# EAGLE design EBN_SBAT_V03A (EAGLE 7.3.0)
CNAME: EasyBoard Nano; CREVISION: 2.0; DESIGNER: Martin Olejar
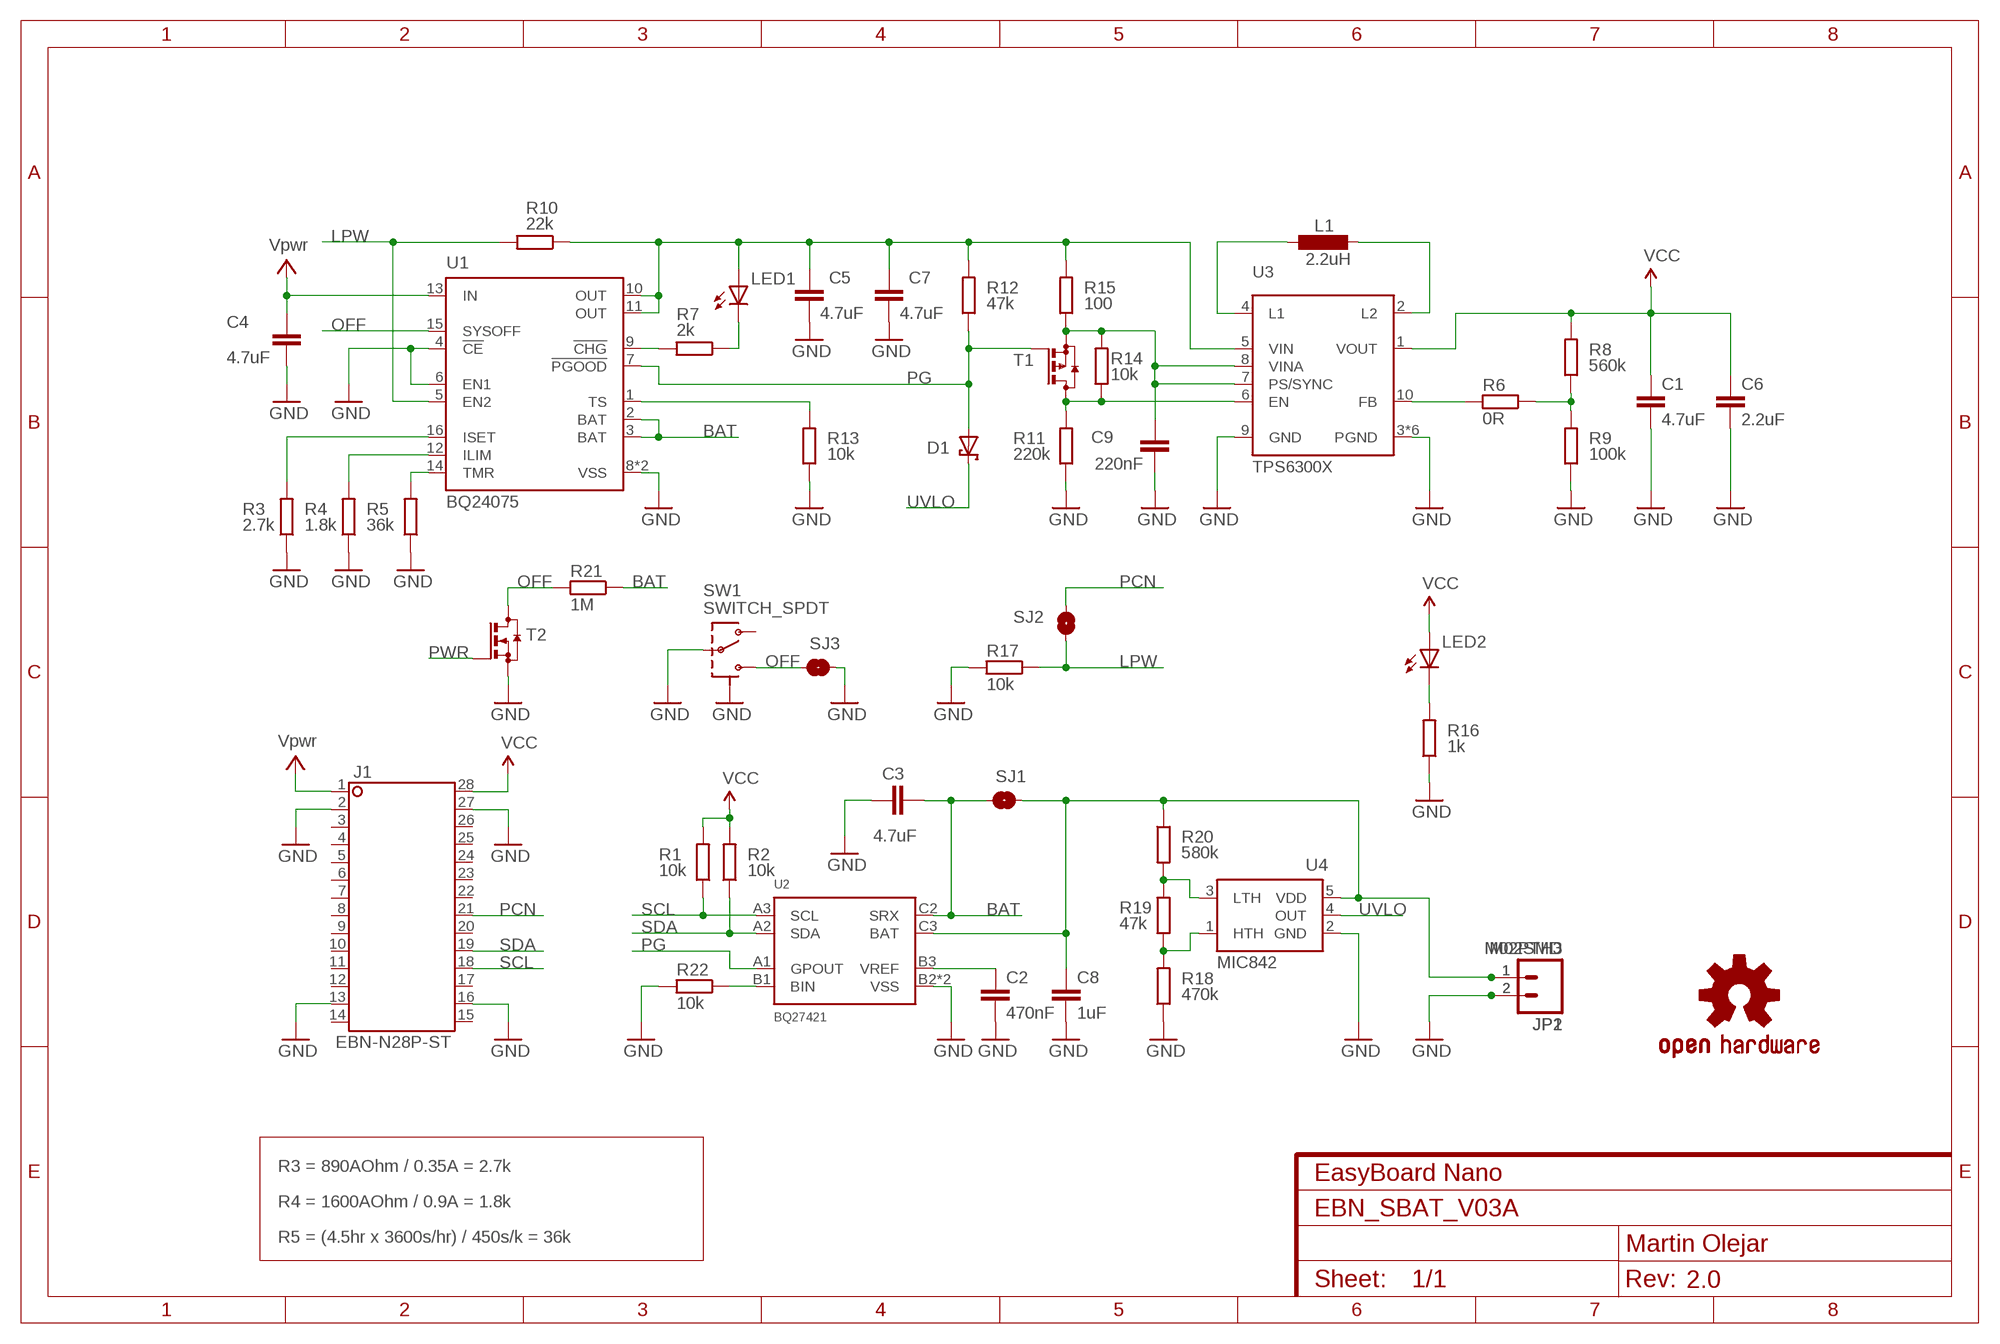
[diagram p0: schematic, sheet 1]

## Parts
C1  4.7uF  C-EUC0603  [C0603]
C2  470nF  C-EUC0402  [C0402]
C3  4.7uF  C-EUC0805  [C0805]
C4  4.7uF  C-EUC0603  [C0603]
C5  4.7uF  C-EUC0603  [C0603]
C6  2.2uF  C-EUC0603  [C0603]
C7  4.7uF  C-EUC0603  [C0603]
C8  1uF  C-EUC0402  [C0402]
C9  220nF  C-EUC0402  [C0402]
D1  -SHOTTKY-SOD323_ST  [SOD323_ST]
J1  EBN-N28P-ST  [EBN-N28P-SHIELD]
JP1  M02SMD  [1X02-1.25MM_SMD]
JP2  M02PTH3  [1X02_LONGPADS]
L1  2.2uH  L-EULPS3015  [LPS3015]
LED1  LEDCHIPLED_0603  [CHIPLED_0603]
LED2  LEDCHIPLED_0603  [CHIPLED_0603]
LOGO1  OSHW-LOGOS  [OSHW-LOGO-S]
R1  10k  R-EUR0402  [R0402]
R2  10k  R-EUR0402  [R0402]
R3  2.7k  R-EUR0402  [R0402]
R4  1.8k  R-EUR0402  [R0402]
R5  36k  R-EUR0402  [R0402]
R6  0R  R-EUR0402  [R0402]
R7  2k  R-EUR0402  [R0402]
R8  560k  R-EUR0402  [R0402]
R9  100k  R-EUR0402  [R0402]
R10  22k  R-EUR0402  [R0402]
R11  220k  R-EUR0402  [R0402]
R12  47k  R-EUR0402  [R0402]
R13  10k  R-EUR0402  [R0402]
R14  10k  R-EUR0402  [R0402]
R15  100  R-EUR0402  [R0402]
R16  1k  R-EUR0402  [R0402]
R17  10k  R-EUR0402  [R0402]
R18  470k  R-EUR0402  [R0402]
R19  47k  R-EUR0402  [R0402]
R20  580k  R-EUR0402  [R0402]
R21  1M  R-EUR0402  [R0402]
R22  10k  R-EUR0402  [R0402]
SJ1  SJ-S  [JUMPER-SMD-S1X]
SJ2  SJ-S  [JUMPER-SMD-S1X]
SJ3  SJ-S  [JUMPER-SMD-S1X]
SW1  SWITCH_SPDT  [SWITCH-SPST-SMD-A]
T1  -PMOS-SOT323  [SOT323]
T2  -NMOS-SOT323  [SOT323]
U1  BQ24075  [QFN16-3X3MM]
U2  BQ27421  [XBGA9]
U3  TPS6300X  [QFN-10_PAD]
U4  MIC842  [SC70]

## Nets
BAT: C3.1 R21.1 SJ1.2 U1.2(BAT) U1.3(BAT) U2.C2(SRX)
BATX: C8.2 JP1.1 JP2.1 R20.1 SJ1.1 U2.C3(BAT) U4.5(VDD)
GND: C1.2 C2.1 C3.2 C4.2 C5.2 C6.2 C7.2 C8.1 C9.2 J1.2 J1.13 J1.16 J1.27 JP1.2 JP2.2 R3.1 R4.1 R5.1 R9.1 R11.1 R13.1 R16.1 R17.2 R18.1 R22.2 SJ3.2 SW1.2(P) SW1.GND1(SH) SW1.GND2(SH) SW1.GND3(SH) SW1.GND4(SH) T2.2(S) U1.4(!CE) U1.6(EN1) U1.8(VSS) U1.EXT(VSS) U2.B2(VSS) U2.C1(VSS) U3.3(PGND) U3.9(GND) U3.11(PGND) U3.12(PGND) U3.13(PGND) U3.14(PGND) U3.15(PGND) U4.2(GND)
LPW: R10.2 R17.1 SJ2.1 U1.5(EN2)
N$1: L1.P$1 U3.4(L1)
N$2: L1.P$2 U3.2(L2)
N$3: LED2.C R16.2
N$4: C2.2 U2.B3(VREF)
N$5: R5.2 U1.14(TMR)
N$6: R4.2 U1.12(ILIM)
N$7: R18.2 R19.1 U4.1(HTH)
N$8: R19.2 R20.2 U4.3(LTH)
N$9: C9.1 R14.2 R15.1 T1.2(S) U3.7(PS/SYNC) U3.8(VINA)
N$10: R22.1 U2.B1(BIN)
N$11: R3.2 U1.16(ISET)
N$12: C5.1 C7.1 LED1.A R10.1 R12.2 R15.2 U1.10(OUT) U1.11(OUT) U3.5(VIN)
N$14: LED1.C R7.1
N$15: R7.2 U1.9(!CHG)
N$16: R11.2 R14.1 T1.3(D) U3.6(EN)
N$21: R6.1 R8.1 R9.2
N$24: R6.2 U3.10(FB)
OFF: R21.2 SJ3.1 SW1.3(S) T2.3(D) U1.15(SYSOFF)
PCN: J1.21 SJ2.2
PG: D1.A R12.1 T1.1(G) U1.7(!PGOOD) U2.A1(GPOUT)
PWR: C4.1 J1.1 T2.1(G) U1.13(IN) ; supply symbol labelled Vpwr
SCL: J1.18 R1.1 U2.A3(SCL)
SDA: J1.19 R2.1 U2.A2(SDA)
TS: R13.2 U1.1(TS)
UVLO: D1.C U4.4(OUT)
VCC: C1.1 C6.1 J1.28 LED2.A R1.2 R2.2 R8.2 U3.1(VOUT)
Unconnected: J1.3 J1.4 J1.5 J1.6 J1.7 J1.8 J1.9 J1.10 J1.11 J1.12 J1.14 J1.15 J1.17 J1.20 J1.22 J1.23 J1.24 J1.25 J1.26 SW1.1(O)

## Notes on the sheet
- R3 = 890AOhm / 0.35A = 2.7k
- R4 = 1600AOhm / 0.9A = 1.8k
- R5 = (4.5hr x 3600s/hr) / 450s/k = 36k

## Library data of the parts
C1-C9 = atomx_RLC:C-EU: CAPACITOR, European symbol
D1 = atomx_DiscreteSemi:*-SHOTTKY-
J1 = atomx_Boards:EBN-N28P: Dual In Line
JP1 JP2 = atomx_Connectors:M02: Standard 2-pin 0.1" header. Use with - straight break away headers ( PRT-00116) - right angle break away headers (PRT-00553) - swiss pins (PRT-00743) - machine pins (PRT-00117) - female headers (PRT-00115) Molex polarized connector foot print use with: PRT-08233 with associated crimp pins and housings. 2.54_SCREWTERM for use with PRT-10571. 3.5mm Screw Terminal footprints for PRT-08084 5mm Screw Terminal footprints for use with PRT-08432
L1 = atomx_RLC:L-EU: INDUCTOR, European symbol
LED1 LED2 = atomx_Optic:LED: LED OSRAM: - CHIPLED LG R971, LG N971, LY N971, LG Q971, LY Q971, LO R971, LY R971 LH N974, LH R974 LS Q976, LO Q976, LY Q976 LO Q996 - Hyper CHIPLED LW Q18S LB Q993, LB Q99A, LB R99A - SideLED LS A670, LO A670, LY A670, LG A670, LP A670 LB A673, LV A673, LT A673, LW A673 LH A674 LY A675 LS A676, LA A676, LO A676, LY A676, LW A676 LS A679, LY A679, LG A679 - Hyper Micro SIDELED® LS Y876, LA Y876, LO Y876, LY Y876 LT Y87S - SmartLED LW L88C, LW L88S LB L89C, LB L89S, LG L890 LS L89K, LO L89K, LY L89K LS L896, LA L896, LO L896, LY L896 - TOPLED LS T670, LO T670, LY T670, LG T670, LP T670 LSG T670, LSP T670, LSY T670, LOP T670, LYG T670 LG T671, LOG T671, LSG T671 LB T673, LV T673, LT T673, LW T673 LH T674 LS T676, LA T676, LO T676, LY T676, LB T676, LH T676, LSB T676, LW T676 LB T67C, LV T67C, LT T67C, LS T67K, LO T67K, LY T67K, LW E67C LS E67B, LA E67B, LO E67B, LY E67B, LB E67C, LV E67C, LT E67C LW T67C LS T679, LY T679, LG T679 LS T770, LO T770, LY T770, LG T770, LP T770 LB T773, LV T773, LT T773, LW T773 LH T774 LS E675, LA E675, LY E675, LS T675 LS T776, LA T776, LO T776, LY T776, LB T776 LHGB T686 LT T68C, LB T68C - Hyper Mini TOPLED® LB M676 - Mini TOPLED Santana® LG M470 LS M47K, LO M47K, LY M47K Source: http://www.osram.convergy.de LUXEON: - LUMILED® LXK2-PW12-R00, LXK2-PW12-S00, LXK2-PW14-U00, LXK2-PW14-V00 LXK2-PM12-R00, LXK2-PM12-S00, LXK2-PM14-U00 LXK2-PE12-Q00, LXK2-PE12-R00, LXK2-PE12-S00, LXK2-PE14-T00, LXK2-PE14-U00 LXK2-PB12-K00, LXK2-PB12-L00, LXK2-PB12-M00, LXK2-PB14-N00, LXK2-PB14-P00, LXK2-PB14-Q00 LXK2-PR12-L00, LXK2-PR12-M00, LXK2-PR14-Q00, LXK2-PR14-R00 LXK2-PD12-Q00, LXK2-PD12-R00, LXK2-PD12-S00 LXK2-PH12-R00, LXK2-PH12-S00 LXK2-PL12-P00, LXK2-PL12-Q00, LXK2-PL12-R00 Source: www.luxeon.com KINGBRIGHT: KA-3528ASYC Source: www.kingbright.com
LOGO1 = atomx_Common:OSHW-LOGO: Open Source Hardware Logo This logo indicates the piece of hardware it is found on incorporates a OSHW license and/or adheres to the definition of open source hardware found here: http://freedomdefined.org/OSHW
R1-R22 = atomx_RLC:R-EU: RESISTOR, European symbol
SJ1-SJ3 = atomx_Connectors:SJ: SMD solder JUMPER
SW1 = atomx_ElecMech:SWITCH_SPDT: SWCH-10651 Side-actuated SPDT slide switch, as used on the Arduino Pro
T1 = atomx_DiscreteSemi:*-PMOS-
T2 = atomx_DiscreteSemi:*-NMOS-
U1 = atomx_Power:BQ24075
U2 = atomx_Power:BQ27421
U3 = atomx_Power:TPS6300X
U4 = atomx_Power:MIC842

## Board
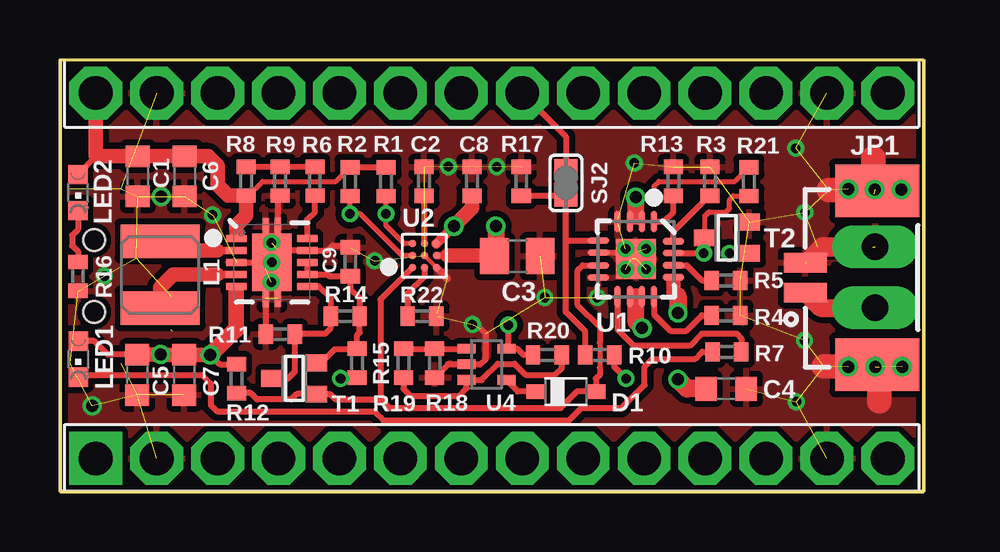
[diagram p1: board, top side]
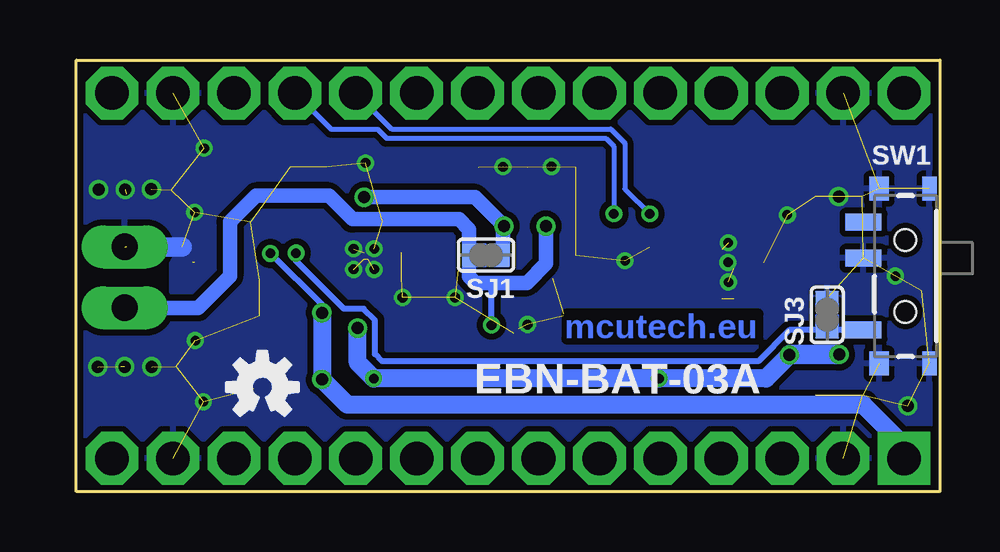
[diagram p2: board, bottom side, seen from below]

Size 36 x 18 mm. Coordinates in mm from the lower left corner, seen from the top.
Outline: 0,0 36,0 36,18 0,18 0,0
Copper layers (1*16): Top 0.035mm / dielectric 1.5mm / Bottom 0.035mm
Design rules "ITEADstudio_DRC *": minimum track width 6mil, minimum drill 12mil, track to track 10mil, track to pad 10mil, pad to pad 10mil, via to via 10mil, smd to smd 10mil, copper to edge 10mil, drill to drill 10mil, minimum pad ring 10mil, minimum via ring 6mil, stop-mask expansion 2mil, vias tented up to drill 100mil, thermal gap 10mil

### Footprints (pad centres in the part's own frame; a part is rotated, then mirrored left to right if it is on the bottom)
C0603 = smd 0.9 x 1: 1 -0.84,0; 2 0.84,0
C0402 = smd 0.6 x 0.8: 1 -0.6,0; 2 0.6,0
C0805 = smd 1.2 x 1.5: 1 -0.95,0; 2 0.95,0
SOD323_ST = smd 0.8 x 0.6: A 1.25,0; C -1.25,0
EBN-N28P-SHIELD = drill 1.4 pad 2.2 square: 1 -16.51,-7.62 | drill 1.4 pad 2.2 octagon: 2 -13.97,-7.62; 3 -11.43,-7.62; 4 -8.89,-7.62; 5 -6.35,-7.62; 6 -3.81,-7.62; 7 -1.27,-7.62; 8 1.27,-7.62; 9 3.81,-7.62; 10 6.35,-7.62; 11 8.89,-7.62; 12 11.43,-7.62; 13 13.97,-7.62; 14 16.51,-7.62; 15 16.51,7.62; 16 13.97,7.62; 17 11.43,7.62; 18 8.89,7.62; 19 6.35,7.62; 20 3.81,7.62; 21 1.27,7.62; 22 -1.27,7.62; 23 -3.81,7.62; 24 -6.35,7.62; 25 -8.89,7.62; 26 -11.43,7.62; 27 -13.97,7.62; 28 -16.51,7.62
1X02-1.25MM_SMD = smd 0.8 x 1.8: 1 0,0; 2 1.25,0 | smd 2.2 x 3.5: P$5 -3,-3; P$6 4.25,-3
1X02_LONGPADS = drill 1.1 pad 1.8 long: 1 0,0; 2 2.54,0
LPS3015 = smd 1.4 x 3.3: P$1 -1.4,0; P$2 1.4,0
CHIPLED_0603 = smd 0.8 x 0.8: A 0,-0.75; C 0,0.75
R0402 = smd 0.6 x 0.8: 1 -0.6,0; 2 0.6,0
JUMPER-SMD-S1X = smd 0.6 x 1: 1 -0.7,0; 2 0.7,0
SWITCH-SPST-SMD-A = smd 0.7 x 1.5: 1 -2.25,-1.75; 2 -0.75,-1.75; 3 2.25,-1.75 | smd 1 x 0.6: GND1 -3.65,1; GND3 3.65,1 | smd 1 x 0.8: GND2 -3.65,-1.1; GND4 3.65,-1.1 | hole 0.9: -1.5,0; 1.5,0
SOT323 = smd 0.7 x 0.9: 1 -0.65,-0.925; 2 0.65,-0.925; 3 0,0.925
QFN16-3X3MM = smd 0.9 x 0.28: 1 -1.56,0.75; 2 -1.56,0.253; 3 -1.56,-0.25; 4 -1.56,-0.774; 9 1.56,-0.77; 10 1.56,-0.245; 11 1.56,0.255; 12 1.56,0.755 | smd 0.28 x 0.9: 5 -0.765,-1.56; 6 -0.265,-1.56; 7 0.263,-1.56; 8 0.763,-1.56; 13 0.758,1.56; 14 0.258,1.56; 15 -0.247,1.56; 16 -0.742,1.56 | smd 1.68 x 1.68: EXT 0,0
XBGA9 = smd 0.32 x 0.32: A1 0.5,-0.5; A2 0,-0.5; A3 -0.5,-0.5; B1 0.5,0; B2 0,0; B3 -0.5,0; C1 0.5,0.5; C2 0,0.5 | smd 0.32 x 0.33: C3 -0.5,0.5
QFN-10_PAD = smd 0.297 x 0.85: 1 -1,-1.475; 2 -0.5,-1.475; 3 0,-1.475; 4 0.5,-1.475; 5 1,-1.475; 6 1,1.475; 7 0.5,1.475; 8 0,1.475; 9 -0.5,1.475; 10 -1,1.475 | smd 0.7 x 0.28: 11 -1.5,0.25; 12 -1.5,-0.25; 13 1.5,0.25; 14 1.5,-0.25 | smd 2.4 x 1.65: 15 0,0
SC70 = smd 0.4 x 0.75: 1 -0.65,-0.825; 2 0,-0.825; 3 0.65,-0.825; 4 0.65,0.825; 5 -0.65,0.825

### Placement (x,y rotation side)
C1  3.24,13.15 270 top
C2  15.18,12.94 270 top
C3  19.07,9.82 0 top
C4  27.77,4.29 0 top
C5  3.22,4.87 270 top
C6  5.2,13.15 270 top
C7  5.18,4.87 270 top
C8  17.18,12.94 270 top
C9  12.1,9.59 90 top
D1  21.09,4.17 0 top
J1  18,9 0 top
JP1  31.07,8.29 90 top
JP2  33.98,7.67 90 top
L1  4.18,9.04 90 top
LED1  0.77,5.52 180 top
LED2  0.75,12.47 180 top
LOGO1  28.25,4.35 0 bottom
R1  13.59,12.93 90 top
R2  12.09,12.93 90 top
R3  27.09,12.94 270 top
R4  27.76,7.34 180 top
R5  27.76,8.81 180 top
R6  10.63,12.95 270 top
R7  27.8,5.83 0 top
R8  7.76,12.95 270 top
R9  9.18,12.95 90 top
R10  22.5,5.7 180 top
R11  9.19,6.56 0 top
R12  7.36,4.71 90 top
R13  25.57,12.94 270 top
R14  11.89,7.31 0 top
R15  12.39,5.35 270 top
R16  0.75,8.98 90 top
R17  19.23,12.94 90 top
R18  15.62,5.35 90 top
R19  14.32,5.35 270 top
R20  20.32,5.7 0 top
R21  28.72,12.93 270 top
R22  15.09,7.31 0 top
SJ1  18.92,9.86 0 bottom
SJ2  21.09,12.88 90 top
SJ3  4.7,7.38 90 bottom
SW1  1.43,8.99 270 bottom
T1  9.77,4.71 90 top
T2  27.81,10.59 90 top
U1  24.01,9.7 270 top
U2  15.19,9.84 270 top
U3  8.83,9.56 270 top
U4  17.78,5.3 270 top

### Tracks (layer width: path | path; a pad name or v marks a point on that pad's centre or on a via)
BAT  (via drill 0.5)
  Top 0.2: R21.1 28.13,12.94 24.96,12.94 24.78,12.76 24.78,12.46 24.6,12.28 v24,12.28
  Top 0.254: U1.2 U1.3 24,11.5
  Top 0.32: U2.C2 16.16,9.84
  Top 0.406: 17.9,9.84 C3.1
  Top 0.61: 16.16,9.84 17.9,9.84
  Top 0.7: 24,11.5 v24,12.28 | v18.17,11.07 18.17,9.87 C3.1
  Bottom 0.61: v24,12.28 19.38,12.28 v18.17,11.07 18.22,11.02 SJ1.2
BATX  (via drill 0.4, 0.5)
  Top 0.254: R20.1 19.33,5.7 19.07,5.96 U4.5 18.69,6.04 v18.69,6.95
  Top 0.406: U2.C3 v16.42,11.07
  Top 0.61: v16.42,11.07 17.18,11.83 C8.2
  Top 0.75: JP1.1 31.7,7.67 JP2.1
  Bottom 0.254: 18.61,8.7 18.62,8.71 | v18.69,6.95 18.69,8.71 18.52,8.71
  Bottom 0.61: 33.96,7.64 JP2.1 30.91,7.67 29.59,8.99 29.59,11.26 28.51,12.34 25.47,12.34 24.49,11.36 20.04,11.36 19.62,10.94 SJ1.1 19.62,8.98 19.35,8.71 18.62,8.71 18.52,8.71 17.22,8.71 16.42,9.51 v16.42,11.07
GND  (via drill 0.4, 0.5)  (64 unrouted)
  Top 0.17: U2.B2 U2.C1
  Top 0.254: U3.3 U3.15 | 9.22,9.95 9.33,10.06 U3.9 11.16,10.06 11.37,10.27 12.09,10.27 C9.2 | 9.22,9.95 U3.15 | R18.1 16.17,5.3 U4.2 17.31,5.29 17.51,5.29 17.75,5.54 17.75,6.58 17.56,6.77 | U1.6 24.01,9.96 v23.58,10.12 | 23.83,9.7 v23.58,10.12 | 24.01,9.88 v23.58,10.12 | R9.1 9.08,12.25 U3.11 9.08,10.1 9.22,9.95 | R11.1 U3.14 8.58,9.31 U3.15 | 15.69,7.42 R22.2 | 33.92,12.41 33.22,12.41 v32.87,12.61 | v35.07,12.6 34.86,12.57 | 34.15,5.2 34.15,5.21 34.16,5.21 | U3.12 8.58,10.62 v8.82,10.38
  Top 0.305: U2.C1 16.14,8.89
  Top 0.813: 33.89,10.21 31.79,10.21 31.14,9.56
  Top 1.016: 32.05,12.57 34.86,12.57 35.18,12.57 | 33.91,13.92 33.92,12.41 | 31.84,5.21 34.16,5.21 34.3,5.21 | 34.16,3.75 34.15,5.2
  Bottom 0.813: JP2.2 31.59,10.21
  other vias: 4.22,12.31 35.11,5.21 32.86,5.21 31.06,11.65 18.21,13.54 31.04,6.29 17.19,6.96 20.21,8.1 16.19,13.56 8.83,9.56 8.81,8.74 6.36,11.54 22.4,8.1 13.12,9.62 1.34,3.57 1.85,8.99 23.94,13.71 30.67,14.32 30.7,3.75 33.96,12.6 33.98,5.21 24.44,10.12 23.58,9.27 24.44,9.27
  pour Bottom: 0,17.99 36,17.99 36,0.01 0,0.01
  pour Top: 0,17.99 36,17.99 36,0.01 0,0.01
LPW
  Top 0.254: R10.2 21.9,6.67 21.09,7.49 21.09,10.47 | 21.09,10.47 U1.5 | R17.1 21.39,12.34 SJ2.1 21.09,10.47
N$1
  Top 0.305: 4.33,7.59 L1.P$1 | U3.4 6.56,9.06
  Top 0.61: 6.56,9.06 4.72,9.06 4.18,8.52 L1.P$1
N$2
  Top 0.305: 4.67,10.06 L1.P$2 | U3.2 6.56,10.06
  Top 0.61: 6.56,10.06 4.67,10.06
N$3
  Top 0.254: LED2.C 0.75,10.93 0.51,10.69 0.51,10.26 0.75,10.02 R16.2
N$4
  Top 0.254: U2.B3 C2.2
N$5
  Top 0.254: U1.14 26.13,9.44 26.76,8.81 R5.2
N$6
  Top 0.254: U1.12 24.77,7.39 25.45,6.71 26.12,6.71 26.76,7.34 R4.2
N$7
  Top 0.254: R19.1 R18.2 U4.1
N$8
  Top 0.254: R19.2 14.32,4.29 14.61,4 16.64,4 16.96,4.31 U4.3 17.58,4.66 18.25,5.33 18.95,5.33 19.41,4.87 20.64,4.87 20.92,5.14 R20.2
N$9
  Top 0.254: U3.8 U3.7 11.15,9.06 11.22,8.99 C9.1 12.09,9.04 12.09,8.46 12.48,8.07 12.48,7.39 R14.2 12.49,6.63 12.39,6.54 R15.1 11.46,5.95 10.89,5.37 T1.2
N$10
  Top 0.254: U2.B1 15.19,8.98 14.49,8.28 R22.1
N$11
  Top 0.254: U1.16 25.57,10.84 27.07,12.34 R3.2
N$12  (via drill 0.4, 0.5)
  Top 0.254: U3.5 7.35,8.29 | R12.2 6.66,5.3 v6.27,5.7 | R15.2 v11.7,4.71 | U1.10 U1.11 | U1.11 | 24.02,8.14 U1.11 | R10.1 23.1,5.21 v23.6,4.71 | C5.1 1.99,5.71 1.43,6.27 LED1.A
  Top 0.305: 7.35,8.29 7.35,8.38
  Top 0.61: C7.1 v4.21,5.71 v4.2,5.71 C5.1 | v6.27,5.7 5.21,5.7 5.2,5.71
  Top 0.65: 7.35,8.38 7.35,6.77
  Top 0.7: 7.35,6.77 v6.27,5.7 | 24.02,8.14 24.02,7.06 v24.27,6.81
  Bottom 0.75: v6.27,5.7 7.25,4.71 v11.7,4.71 v23.6,4.71 24.27,5.38 v24.27,6.81
  Bottom 0.813: v4.2,5.71 6.25,5.71 v6.27,5.7
N$13
  cutout Top: 32.25,9.46 32.25,8.39 35.77,8.39 35.77,9.48 32.25,9.48
N$14
  Top 0.254: LED1.C 0.85,4.85 5.93,4.85 6.29,4.5 6.29,3.6 6.55,3.34 13.1,3.34 13.48,2.96 21.21,2.96 21.72,3.48 21.73,3.46 23.39,3.46 24.37,4.45 24.37,5.21 24.7,5.54 26.48,5.54 26.77,5.83 R7.1
N$15
  Top 0.254: U1.9 23.24,6.75 23.92,6.08 26.25,6.08 26.76,6.58 28.21,6.58 28.4,6.39 R7.2
N$16
  Top 0.254: U3.6 10.79,8.56 11.28,8.07 R14.1 | R14.1 | R14.1 11.28,6.8 11.05,6.58 R11.2 9.79,5 9.51,4.71 T1.3
N$17
  cutout Bottom: 32.25,9.46 32.25,8.39 35.77,8.39 35.77,9.46
N$21
  Top 0.254: R8.1 R9.2 R6.1
N$24
  Top 0.254: U3.10 10.3,11.34 10.63,11.67 R6.2
OFF  (via drill 0.4)  (1 unrouted)
  Top 0.2: v26.84,9.95 26.84,10.04 | T2.3 26.89,11.49 27.06,11.67 27.77,11.67 27.91,11.81 27.91,12.17 28.07,12.33 R21.2
  Top 0.254: U1.15 v26.84,9.94 v26.84,9.95
  Top 0.406: 26.84,10.04 26.89,10.04 T2.3
  Bottom 0.254: v26.84,9.95 26.84,9.62 24.84,7.62 24.02,7.62 23.55,7.16 23.55,5.74 23.25,5.43 7.57,5.43 6.27,6.74 SW1.3 4.64,6.74
PCN
  Top 0.254: J1.21 21.09,14.8 SJ2.2
PG
  Top 0.2: 22.5,6.21 22.5,5.17
  Top 0.254: U2.A1 13.36,8.01 13.36,3.85 | U1.7 21.8,9.44 21.58,9.22 21.58,7.77 22.5,6.85 22.5,6.21 | R12.1 7.95,4.1 8.22,3.83 9.64,3.83 9.87,4.06 T1.1 11.26,4.06 11.48,3.84 13.36,3.84 13.36,3.85 | 22.5,5.17 22.5,4.88 22.34,4.71 D1.A 21.56,4.17 20.87,3.48 13.73,3.48 13.36,3.85
PWR  (via drill 0.4, 0.5)
  Top 0.2: 28.31,9.94 v27.91,9.94
  Top 0.254: U1.13 25.57,8.71
  Top 0.406: T2.1 v27.91,9.94
  Top 0.61: 25.57,8.71 25.57,8.35 25.76,8.16
  Top 0.75: 25.76,8.16 v25.76,7.46 | C4.1 26.14,4.29 v25.76,4.67
  Bottom 0.254: v27.91,9.94 27.89,9.94 25.76,7.8 v25.76,7.46
  Bottom 0.75: J1.1 1.49,1.91 3.19,3.61 24.7,3.61 v25.76,4.67 v25.76,7.46
SCL  (via drill 0.4)
  Top 0.2: R1.1 v13.59,11.59 13.59,11.1 14.35,10.34 U2.A3
  Bottom 0.2: J1.18 25.38,15.11 23.44,15.11 23.07,14.74 13.92,14.74 13.59,14.41 v13.59,11.59
SDA  (via drill 0.4)
  Top 0.2: U2.A2 14.25,9.84 12.5,11.59 v12.09,11.59 R2.1
  Bottom 0.2: J1.19 22.86,15.12 13.72,15.12 13.13,14.54 13.13,12.62 v12.09,11.59
TS
  Top 0.254: U1.1 25.18,11.26 25.57,11.65 R13.2
UVLO
  Top 0.254: D1.C 19.09,4.17 U4.4
VCC
  Top 0.2: 7.85,12.35 8.44,12.94 11.5,12.94 R2.2
  Top 0.254: R8.2 7.85,12.35 | R2.2 R1.2 | LED2.A 0.75,13.24 1.49,13.99
  Top 0.305: U3.1 7.35,10.74
  Top 0.61: 7.35,10.74 7.35,11.1 7.76,11.51 R8.2 7,12.35 6.57,12.78 6.57,13.6 6.18,13.99 C6.1 C1.1 1.49,13.99 J1.28

### Text on the board
Bottom: mcutech.eu
bPlace: EBN-BAT-03A